# EAGLE schematic main (EAGLE 9.6.2)
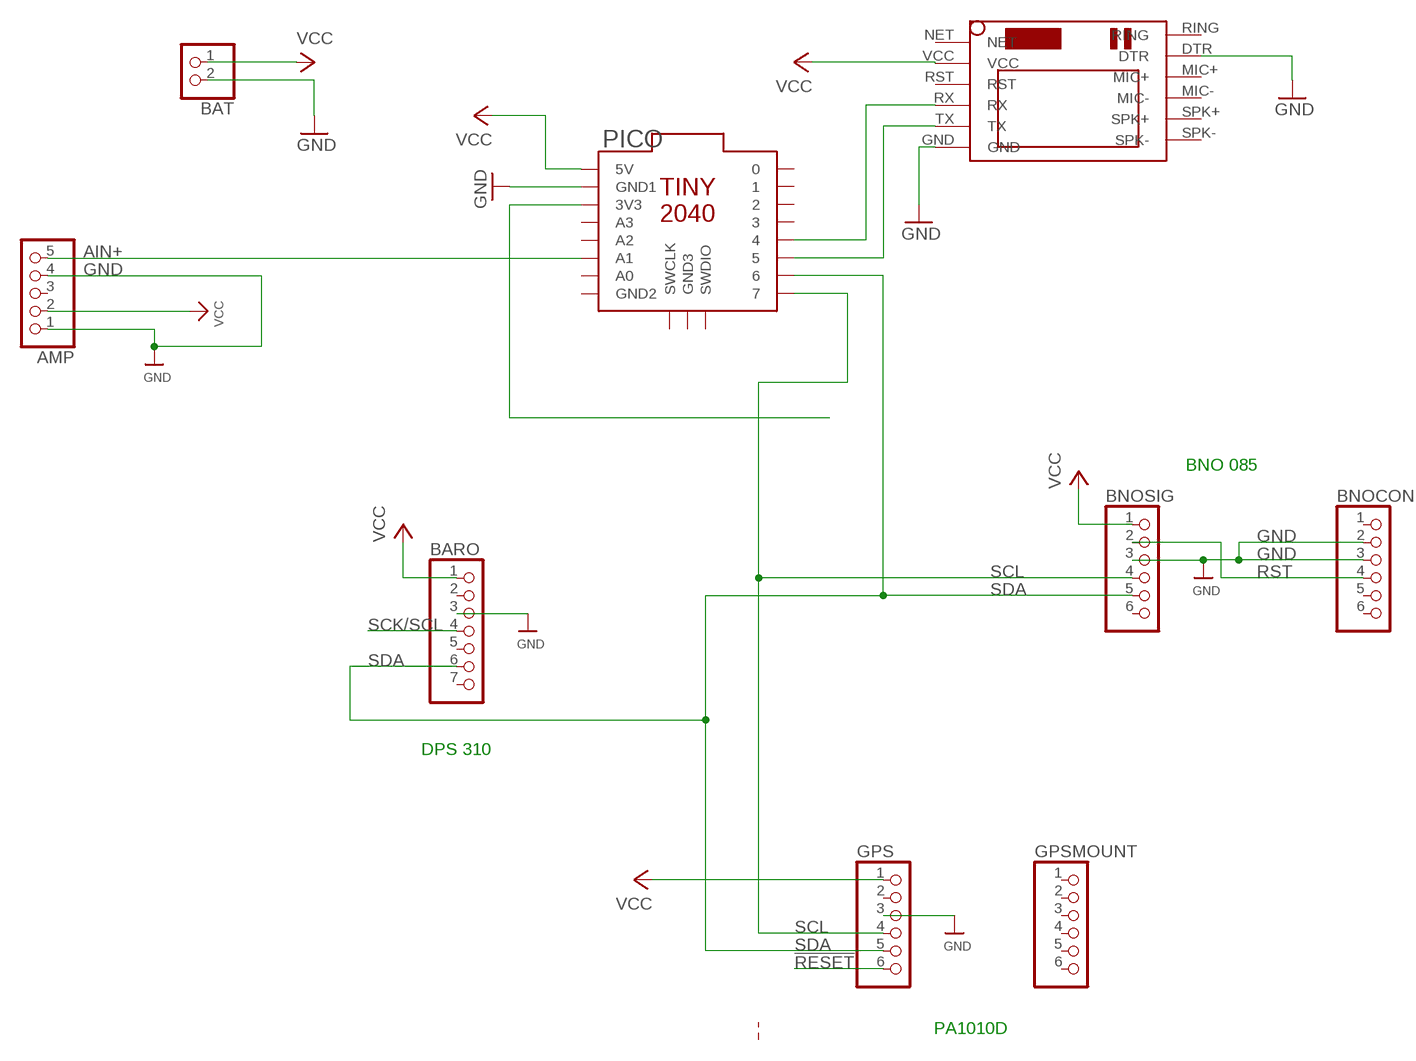
[diagram p0: schematic, sheet 1]

## Parts
AMP  HEADER-1X570MIL  [1X05_ROUND_70]
BARO  HEADER-1X770MIL  [1X07_ROUND_70]
BAT  JST_2PIN-THM-RA  [JST-PH-2-THM-RA]
BNOCON  HEADER-1X670MIL  [1X06_ROUND_70]
BNOSIG  HEADER-1X670MIL  [1X06_ROUND_70]
GPS  HEADER-1X670MIL  [1X06_ROUND_70]
GPSMOUNT  HEADER-1X670MIL  [1X06_ROUND_70]
PICO  TINY2040  [TINY2040]
SIM  SIM800LMODULE  [SIM800LMODULE]

## Nets
!RESET: GPS.6
AIN+: AMP.5 PICO.A1
GND [lowpower]: AMP.1 AMP.4 BARO.3 BAT.2 BNOCON.2 BNOCON.3 BNOSIG.3 GPS.3 PICO.GND1 SIM.DTR SIM.GND
N$1: PICO.4 SIM.RX
N$2: PICO.5 SIM.TX
N$4 [lowpower]: PICO.3V3
RST: BNOCON.4 BNOSIG.2
SCK/SCL: BARO.4
SCL: BNOSIG.4 GPS.4 PICO.7
SDA: BARO.6 BNOSIG.5 GPS.5 PICO.6
VCC [lowpower]: AMP.2 BARO.1 BAT.1 BNOSIG.1 GPS.1 PICO.5V SIM.VCC
Unconnected: AMP.3 BARO.2 BARO.5 BARO.7 BNOCON.1 BNOCON.5 BNOCON.6 BNOSIG.6 GPS.2 GPSMOUNT.1 GPSMOUNT.2 GPSMOUNT.3 GPSMOUNT.4 GPSMOUNT.5 GPSMOUNT.6 PICO.0 PICO.1 PICO.2 PICO.3 PICO.A0 PICO.A2 PICO.A3 PICO.GND2 PICO.GND3 PICO.SWCLK PICO.SWDIO SIM.MIC+ SIM.MIC- SIM.NET SIM.RING SIM.RST SIM.SPK+ SIM.SPK-

## Notes on the sheet
- BNO 085
- DPS 310
- PA1010D

## Library data of the parts
AMP = microbuilder:HEADER-1X5: PIN HEADER
BARO = microbuilder:HEADER-1X7: PIN HEADER
BAT = adafruit:JST_2PIN: JST 2-Pin Connectors of various flavors SMT-RA (S2B-PH-SM4) 4UConnector #17311 SMT (B2B-PH-SM4) THM-RA (S2B-PH) THM (B2B-PH)
BNOCON BNOSIG GPS GPSMOUNT = microbuilder:HEADER-1X6: PIN HEADER
PICO = pimoroni-boards:TINY2040
SIM = SIM800LMODULE:SIM800LMODULE: SIM800L Module

## Net classes
1 highpower: width 0.305 mm, drill 0.483 mm
2 lowpower: width 0.254 mm, drill 0.381 mm